# EAGLE board NEW LINE EN (EAGLE 9.6.2)
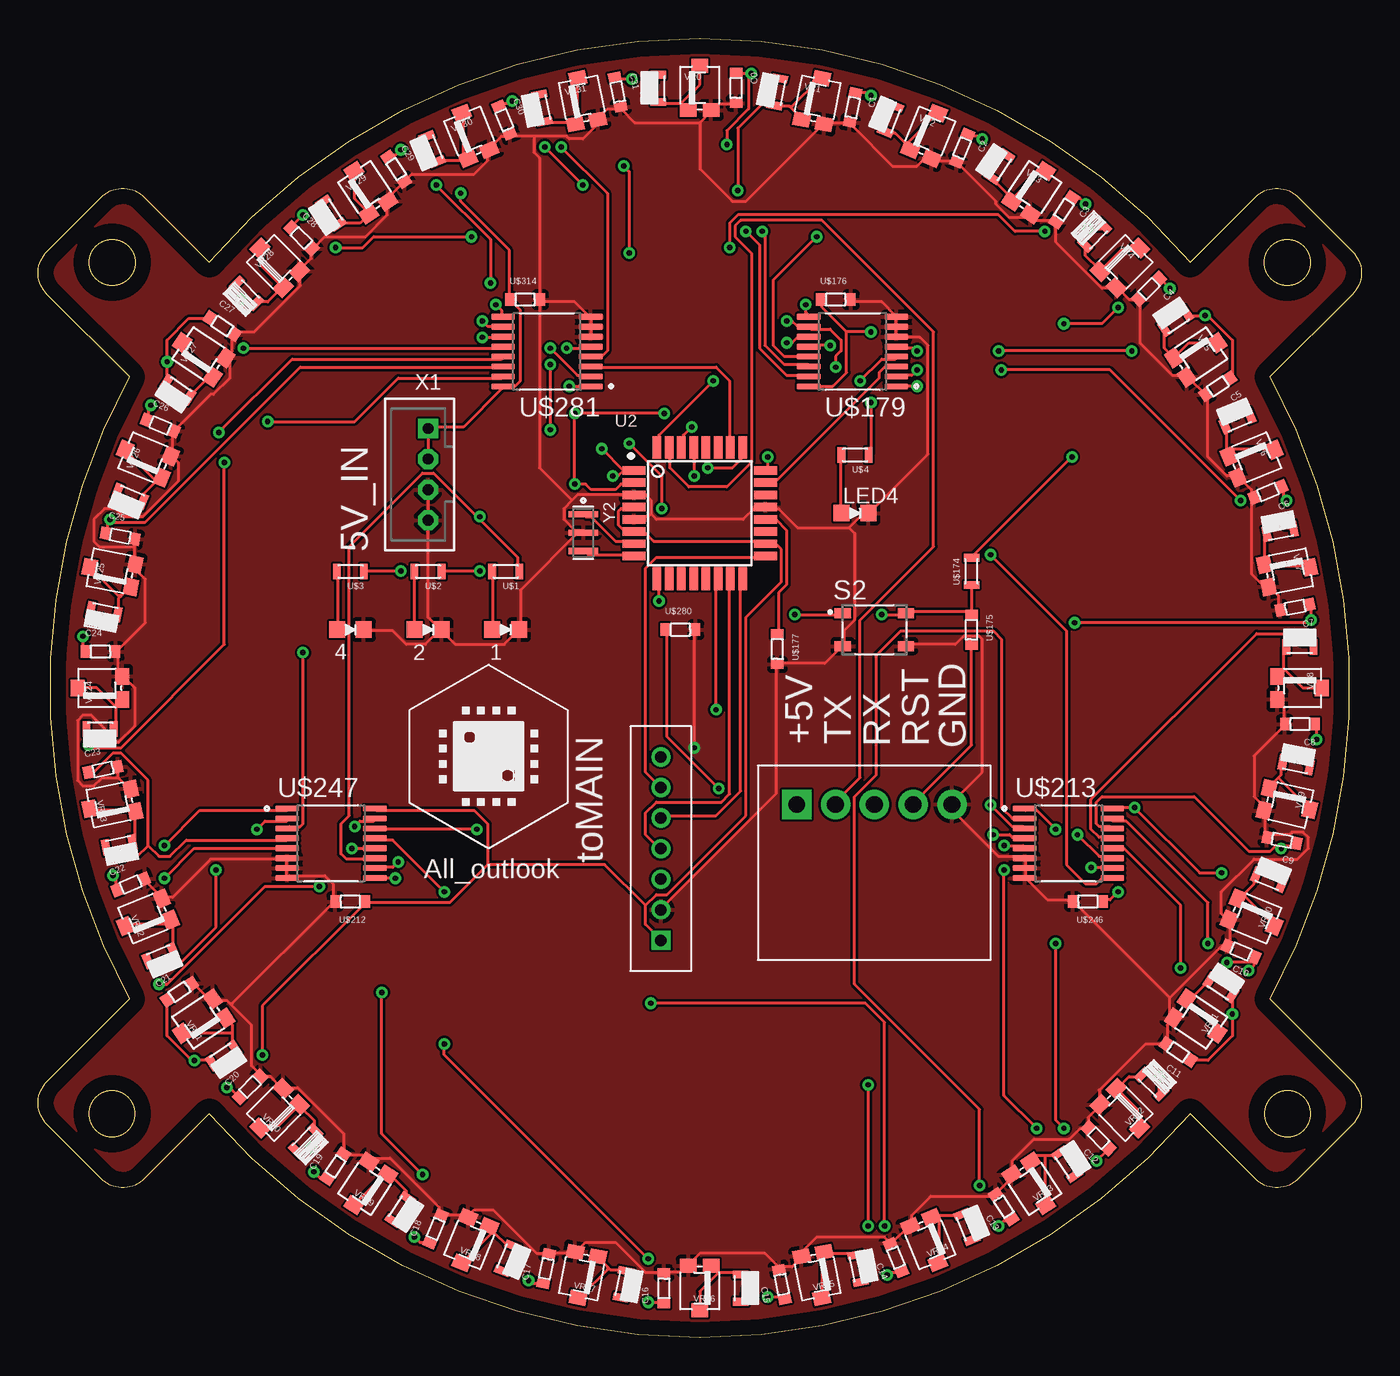
[diagram p2: board, top side]
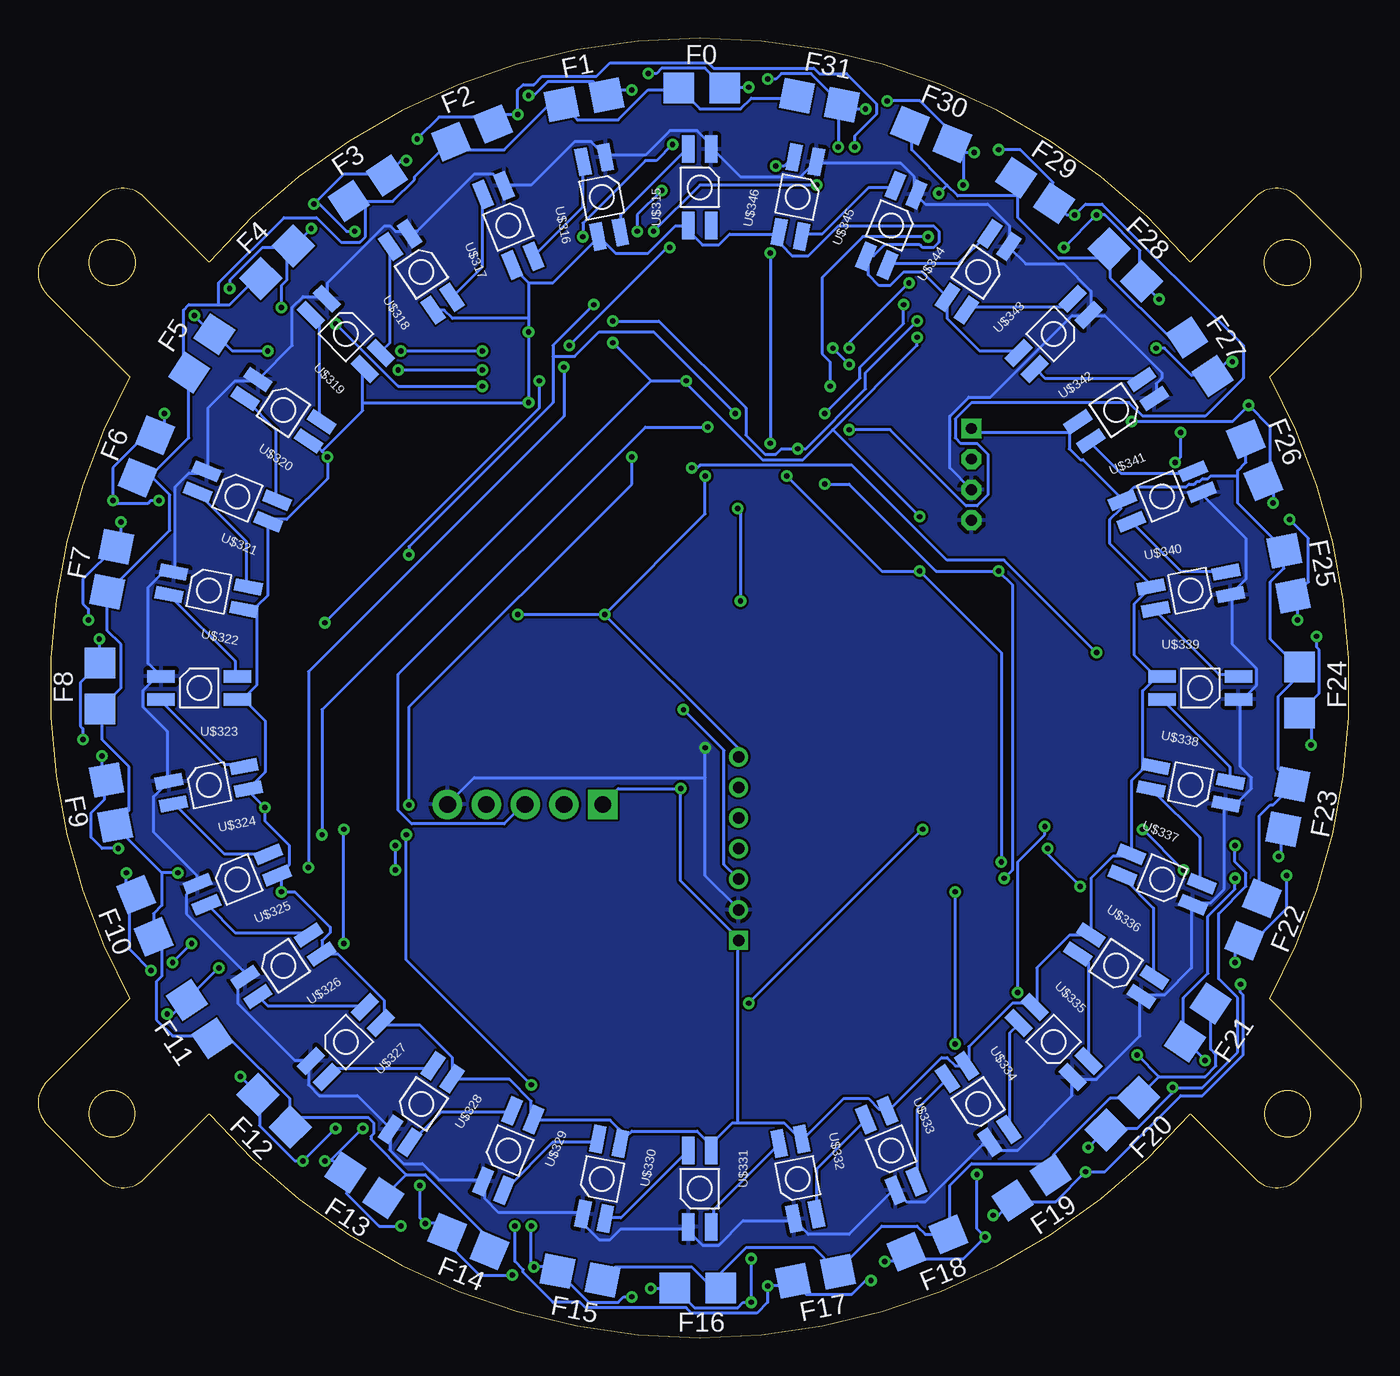
[diagram p3: board, bottom side, seen from below]

Size 86.58 x 85 mm. Coordinates in mm from the lower left corner, seen from the top.
Outline: 5.97,22.16 arc-57 5.97,62.84 0.58,68.23 arc-90 0.58,71.06 4.12,74.6 arc-90 6.95,74.6 11.19,70.36 arc-98 75.39,70.36 79.63,74.6 arc-90 82.46,74.6 85.99,71.06 arc-90 85.99,68.23 80.6,62.84 arc-57 80.6,22.16 85.99,16.77 arc-90 85.99,13.94 82.46,10.4 arc-90 79.63,10.4 75.39,14.64 arc-98 11.19,14.64 6.95,10.4 arc-90 4.12,10.4 0.58,13.94 arc-90 0.58,16.77 5.97,22.16
Outline: circle at 81.75,14.65 radius 1.5
Outline: circle at 4.85,70.34 radius 1.5
Outline: circle at 4.83,14.65 radius 1.5
Outline: circle at 81.73,70.34 radius 1.5
Copper layers (1*16): Top 0.035mm / dielectric 1.5mm / Bottom 0.035mm
Design rules "default": minimum track width 6mil, minimum drill 0.35mm, track to track 6mil, track to pad 6mil, pad to pad 6mil, via to via 6mil, smd to smd 6mil, copper to edge 40mil, drill to drill 6mil, minimum pad ring 10mil, minimum via ring 8mil, stop-mask expansion 4mil, vias tented up to drill 0mil, thermal gap 10mil
Net classes: 0 default: width 0.203 mm, clearance 0.127 mm

## Footprints (pad centres in the part's own frame; a part is rotated, then mirrored left to right if it is on the bottom)
LED1608 = smd 1.05 x 1.08: A -0.875,0; K 0.875,0
CON = smd 0.6 x 0.813: P$1 -1,0; P$2 1,0
PHOTO = smd 2 x 2 bottom: P$1 -1.365,0; P$2 1.635,0
1608 = smd 0.508 x 1.016: P$1 -0.889,0; P$2 0.889,0
SW_SKRPACE010 = smd 1.05 x 0.65: 1 -2.075,1.075; 2 2.075,1.075; 3 -2.075,-1.075; 4 2.075,-1.075
QFP80P900X900X120-32N = smd 1.5 x 0.55: 1 -4.3,2.8; 2 -4.3,2; 3 -4.3,1.2; 4 -4.3,0.4; 5 -4.3,-0.4; 6 -4.3,-1.2; 7 -4.3,-2; 8 -4.3,-2.8; 17 4.3,-2.8; 18 4.3,-2; 19 4.3,-1.2; 20 4.3,-0.4; 21 4.3,0.4; 22 4.3,1.2; 23 4.3,2; 24 4.3,2.8 | smd 0.55 x 1.5: 9 -2.8,-4.3; 10 -2,-4.3; 11 -1.2,-4.3; 12 -0.4,-4.3; 13 0.4,-4.3; 14 1.2,-4.3; 15 2,-4.3; 16 2.8,-4.3; 25 2.8,4.3; 26 2,4.3; 27 1.2,4.3; 28 0.4,4.3; 29 -0.4,4.3; 30 -1.2,4.3; 31 -2,4.3; 32 -2.8,4.3
SPI = drill 0.75 square: P$1 0,0 | drill 0.75: P$2 2,0; P$3 4,0; P$4 6,0; P$5 8,0; P$6 10,0; P$7 12,0
SI = drill 1.1 pad 1.93 square: P$1 -7.62,0 | drill 1.1 pad 1.93: P$2 -5.08,0; P$3 -2.54,0; P$4 0,0; P$5 2.54,0
SOP65P640X120-16N = smd 1.57 x 0.41: 1 -2.87,2.275; 2 -2.87,1.625; 3 -2.87,0.975; 4 -2.87,0.325; 5 -2.87,-0.325; 6 -2.87,-0.975; 7 -2.87,-1.625; 8 -2.87,-2.275; 9 2.87,-2.275; 10 2.87,-1.625; 11 2.87,-0.975; 12 2.87,-0.325; 13 2.87,0.325; 14 2.87,0.975; 15 2.87,1.625; 16 2.87,2.275
LED = smd 1.8 x 0.82: P$1 -2.5,0.75; P$2 -2.5,-0.75; P$3 2.5,-0.75; P$4 2.5,0.75
VR = smd 1.1 x 0.9: P$1 0,1.45; P$2 -0.75,-1.45; P$3 0.75,-1.45
B4B-PH-K-S = drill 0.7 pad 1.3 square: 1 3,0 | drill 0.7 pad 1.3 octagon: 2 1,0; 3 -1,0; 4 -3,0
OSC_CSTCE16M0V53-R0 = smd 0.4 x 1.9: 1 -1.2,0; 2 0,0; 3 1.2,0

## Placement (x,y rotation side)
1  LED1608  [LED1608]  30.59,46.31 0 top
2  LED1608  [LED1608]  25.51,46.31 0 top
4  LED1608  [LED1608]  20.43,46.31 0 top
C0  1608  [CON]  45.66,81.76 270 top
C1  1608  [CON]  53.3,80.46 258.7 top
C2  1608  [CON]  60.46,77.81 247.5 top
C3  1608  [CON]  67.13,73.78 236.2 top
C4  1608  [CON]  72.69,68.61 225 top
C5  1608  [CON]  77.2,62.24 213.7 top
C6  1608  [CON]  80.47,55.32 202.5 top
C7  1608  [CON]  82.25,47.78 191.2 top
C8  1608  [CON]  82.57,40.14 180 top
C9  1608  [CON]  81.39,32.53 168.7 top
C10  1608  [CON]  78.71,25.27 157.5 top
C11  1608  [CON]  74.59,18.69 146.2 top
C12  1608  [CON]  69.39,13.05 135 top
C13  1608  [CON]  63.18,8.57 123.7 top
C14  1608  [CON]  56.13,5.24 112.5 top
C15  1608  [CON]  48.66,3.49 101.2 top
C16  1608  [CON]  40.94,3.23 90 top
C17  1608  [CON]  33.24,4.52 78.7 top
C18  1608  [CON]  26,7.12 67.5 top
C19  1608  [CON]  19.45,11.21 56.2 top
C20  1608  [CON]  13.86,16.4 45 top
C21  1608  [CON]  9.24,22.63 33.7 top
C22  1608  [CON]  6.05,29.65 22.5 top
C23  1608  [CON]  4.24,37.17 11.2 top
C24  1608  [CON]  4.07,44.88 0 top
C25  1608  [CON]  5.37,52.43 348.8 top
C26  1608  [CON]  8,59.67 337.5 top
C27  1608  [CON]  12.05,66.17 326.3 top
C28  1608  [CON]  17.23,71.93 315 top
C29  1608  [CON]  23.43,76.44 303.8 top
C30  1608  [CON]  30.5,79.65 292.5 top
C31  1608  [CON]  37.92,81.49 281.3 top
F0  PHOTO  [PHOTO]  43.29,81.75 180 top
F1  PHOTO  [PHOTO]  50.98,80.96 168.7 top
F2  PHOTO  [PHOTO]  58.31,78.76 157.5 top
F3  PHOTO  [PHOTO]  65.12,75.12 146.2 top
F4  PHOTO  [PHOTO]  71.04,70.25 135 top
F5  PHOTO  [PHOTO]  75.94,64.28 123.7 top
F6  PHOTO  [PHOTO]  79.55,57.52 112.5 top
F7  PHOTO  [PHOTO]  81.79,50.12 101.2 top
F8  PHOTO  [PHOTO]  82.54,42.5 90 top
F9  PHOTO  [PHOTO]  81.79,34.88 78.8 top
F10  PHOTO  [PHOTO]  79.55,27.48 67.5 top
F11  PHOTO  [PHOTO]  75.94,20.72 56.3 top
F12  PHOTO  [PHOTO]  71.04,14.75 45 top
F13  PHOTO  [PHOTO]  65.12,9.88 33.8 top
F14  PHOTO  [PHOTO]  58.31,6.24 22.5 top
F15  PHOTO  [PHOTO]  50.98,4.04 11.3 top
F16  PHOTO  [PHOTO]  43.29,3.25 0 top
F17  PHOTO  [PHOTO]  35.6,4.04 348.8 top
F18  PHOTO  [PHOTO]  28.27,6.24 337.5 top
F19  PHOTO  [PHOTO]  21.45,9.88 326.3 top
F20  PHOTO  [PHOTO]  15.53,14.75 315 top
F21  PHOTO  [PHOTO]  10.63,20.72 303.8 top
F22  PHOTO  [PHOTO]  7.03,27.48 292.5 top
F23  PHOTO  [PHOTO]  4.79,34.88 281.3 top
F24  PHOTO  [PHOTO]  4.04,42.5 270 top
F25  PHOTO  [PHOTO]  4.79,50.12 258.8 top
F26  PHOTO  [PHOTO]  7.03,57.52 247.5 top
F27  PHOTO  [PHOTO]  10.63,64.28 236.3 top
F28  PHOTO  [PHOTO]  15.53,70.25 225 top
F29  PHOTO  [PHOTO]  21.45,75.12 213.8 top
F30  PHOTO  [PHOTO]  28.27,78.76 202.5 top
F31  PHOTO  [PHOTO]  35.6,80.96 191.3 top
LED4  LED1608  [LED1608]  53.45,53.93 0 top
R0  R  [1608]  40.58,81.72 90 top
R1  R  [1608]  48.36,81.49 78.7 top
R2  R  [1608]  55.76,79.72 67.5 top
R3  R  [1608]  62.9,76.61 56.2 top
R4  R  [1608]  69.12,72.09 45 top
R5  R  [1608]  74.42,66.49 33.7 top
R6  R  [1608]  78.48,59.96 22.5 top
R7  R  [1608]  81.26,52.74 11.2 top
R8  R  [1608]  82.56,45.19 0 top
R9  R  [1608]  82.32,37.47 348.8 top
R10  R  [1608]  80.54,29.97 337.5 top
R11  R  [1608]  77.4,22.9 326.3 top
R12  R  [1608]  72.87,16.59 315 top
R13  R  [1608]  67.32,11.35 303.8 top
R14  R  [1608]  60.76,7.25 292.5 top
R15  R  [1608]  53.64,4.53 281.3 top
R16  R  [1608]  45.97,3.25 270 top
R17  R  [1608]  38.3,3.5 258.8 top
R18  R  [1608]  30.72,5.19 247.5 top
R19  R  [1608]  23.69,8.39 236.3 top
R20  R  [1608]  17.49,12.88 225 top
R21  R  [1608]  12.12,18.46 213.8 top
R22  R  [1608]  8,24.99 202.5 top
R23  R  [1608]  5.3,32.25 191.3 top
R24  R  [1608]  4.05,39.82 180 top
R25  R  [1608]  4.31,47.48 168.8 top
R26  R  [1608]  6.01,55.04 157.5 top
R27  R  [1608]  9.14,62.03 146.3 top
R28  R  [1608]  13.62,68.32 135 top
R29  R  [1608]  19.15,73.58 123.8 top
R30  R  [1608]  25.78,77.76 112.5 top
R31  R  [1608]  32.96,80.44 101.3 top
S2  SKRPACE010  [SW_SKRPACE010]  54.72,46.31 0 top
U2  ATMEGA328P-AU  [QFP80P900X900X120-32N]  43.29,53.93 0 top
U$1  R  [1608]  30.59,50.12 180 top
U$2  R  [1608]  25.51,50.12 180 top
U$3  R  [1608]  20.43,50.12 180 top
U$4  R  [1608]  53.45,57.74 180 top
U$5  SPI  [SPI]  40.75,25.99 90 top
U$6  SI  [SI]  57.26,34.88 0 top
U$7  ALL  [ALL]  29.47,38.03 0 top
U$174  R  [1608]  61.07,50.12 90 top
U$175  1608  [CON]  61.07,46.31 270 top
U$176  1608  [CON]  52.18,67.9 0 top
U$177  1608  [CON]  48.37,45.04 270 top
U$179  AM  [SOP65P640X120-16N]  53.29,64.5 180 top
U$212  1608  [CON]  20.43,28.53 180 top
U$213  AM  [SOP65P640X120-16N]  67.42,32.34 0 top
U$246  1608  [CON]  68.69,28.53 180 top
U$247  AM  [SOP65P640X120-16N]  19.16,32.34 0 top
U$280  1608  [CON]  42.02,46.31 0 top
U$281  AM  [SOP65P640X120-16N]  33.29,64.5 180 top
U$314  1608  [CON]  31.86,67.9 0 top
U$315  LED  [LED]  43.29,75.25 90 bottom
U$316  LED  [LED]  49.71,74.62 101.3 bottom
U$317  LED  [LED]  55.82,72.76 112.5 bottom
U$318  LED  [LED]  61.51,69.72 123.8 bottom
U$319  LED  [LED]  66.45,65.66 135 bottom
U$320  LED  [LED]  70.54,60.67 146.3 bottom
U$321  LED  [LED]  73.55,55.03 157.5 bottom
U$322  LED  [LED]  75.41,48.86 168.8 bottom
U$323  LED  [LED]  76.04,42.5 180 bottom
U$324  LED  [LED]  75.41,36.14 191.2 bottom
U$325  LED  [LED]  73.55,29.97 202.5 bottom
U$326  LED  [LED]  70.54,24.33 213.7 bottom
U$327  LED  [LED]  66.45,19.34 225 bottom
U$328  LED  [LED]  61.51,15.29 236.2 bottom
U$329  LED  [LED]  55.82,12.24 247.5 bottom
U$330  LED  [LED]  49.71,10.39 258.7 bottom
U$331  LED  [LED]  43.29,9.75 270 bottom
U$332  LED  [LED]  36.87,10.39 281.2 bottom
U$333  LED  [LED]  30.76,12.24 292.5 bottom
U$334  LED  [LED]  25.07,15.29 303.7 bottom
U$335  LED  [LED]  20.13,19.34 315 bottom
U$336  LED  [LED]  16.04,24.33 326.2 bottom
U$337  LED  [LED]  13.03,29.97 337.5 bottom
U$338  LED  [LED]  11.16,36.14 348.7 bottom
U$339  LED  [LED]  10.54,42.5 0 bottom
U$340  LED  [LED]  11.16,48.86 11.2 bottom
U$341  LED  [LED]  13.03,55.03 22.5 bottom
U$342  LED  [LED]  16.04,60.67 33.7 bottom
U$343  LED  [LED]  20.13,65.66 45 bottom
U$344  LED  [LED]  25.07,69.72 56.2 bottom
U$345  LED  [LED]  30.76,72.76 67.5 bottom
U$346  LED  [LED]  36.87,74.62 78.7 bottom
VR0  VR  [VR]  43.29,81.75 0 top
VR1  VR  [VR]  50.98,80.96 348.7 top
VR2  VR  [VR]  58.31,78.76 337.5 top
VR3  VR  [VR]  65.12,75.12 326.2 top
VR4  VR  [VR]  71.04,70.25 315 top
VR5  VR  [VR]  75.94,64.28 303.7 top
VR6  VR  [VR]  79.55,57.52 292.5 top
VR7  VR  [VR]  81.79,50.12 281.2 top
VR8  VR  [VR]  82.54,42.5 270 top
VR9  VR  [VR]  81.79,34.88 256.8 top
VR10  VR  [VR]  79.55,27.48 247.5 top
VR11  VR  [VR]  75.94,20.72 236.3 top
VR12  VR  [VR]  71.04,14.75 225 top
VR13  VR  [VR]  65.12,9.88 213.8 top
VR14  VR  [VR]  58.31,6.24 202.5 top
VR15  VR  [VR]  50.98,4.04 191.3 top
VR16  VR  [VR]  43.29,3.25 180 top
VR17  VR  [VR]  35.6,4.04 168.8 top
VR18  VR  [VR]  28.27,6.24 157.5 top
VR19  VR  [VR]  21.45,9.88 146.3 top
VR20  VR  [VR]  15.53,14.75 135 top
VR21  VR  [VR]  10.63,20.72 123.8 top
VR22  VR  [VR]  7.03,27.48 112.5 top
VR23  VR  [VR]  4.79,34.88 101.3 top
VR24  VR  [VR]  4.04,42.5 90 top
VR25  VR  [VR]  4.79,50.12 78.8 top
VR26  VR  [VR]  7.03,57.52 67.5 top
VR27  VR  [VR]  10.63,64.28 56.3 top
VR28  VR  [VR]  15.53,70.25 45 top
VR29  VR  [VR]  21.45,75.12 33.8 top
VR30  VR  [VR]  28.27,78.76 22.5 top
VR31  VR  [VR]  35.6,80.96 11.3 top
X1  B4B-PH-K-S  [B4B-PH-K-S]  25.51,56.47 90 top
Y2  CSTCE16M0V53-R0  [OSC_CSTCE16M0V53-R0]  35.67,52.66 270 top

## Tracks (layer width: path | path; a pad name or v marks a point on that pad's centre or on a via)
+5V  (via drill 0.35)
  Top 0.203: X1.2 X1.1 25.51,59.57 27.82,59.57 30.31,62.06 U$281.16 30.49,62.24 31.2,62.24 31.55,62.59 31.55,67.21 31.02,67.75 U$314.P$1 30.84,67.93 30.84,71.13 27.64,74.33 v27.64,74.86 | 52.89,65.79 51.29,67.39 51.29,67.75 U$176.P$1 | 52.89,65.79 52.89,63.13 52,62.24 50.58,62.24 U$179.16 | v54.49,61.17 54.49,57.79 U$4.P$1 | v54.49,65.79 52.89,65.79 | U$213.16 70.31,34.68 v71.74,34.68 76,30.41 v77.43,30.41 | v70.67,29.17 70.14,28.63 69.78,28.63 U$246.P$1 | v67.65,57.61 61.07,51.03 U$174.P$2 | v44.53,35.92 41.15,39.3 41.15,46.23 U$280.P$1 | 29.42,30.94 26.93,28.45 21.6,28.45 U$212.P$1 21.42,28.45 14.66,21.7 v14.66,18.5 | 29.42,30.94 29.42,33.61 28.53,34.5 22.13,34.5 U$247.16 | U2.4 38.84,54.24 38.13,54.24 37.95,54.06 37.95,53.17 38.31,52.81 38.84,52.81 U2.6 39.02,52.64 39.73,52.64 40.27,52.1 47.56,52.1 U2.18 47.73,51.92 48.27,51.92 48.62,51.57 48.62,49.43 46.31,47.12 46.31,34.14 41.15,28.99 40.44,28.99 39.73,28.28 | 39.73,28.28 39.73,27.03 40.62,26.14 U$5.P$1 | 29.42,30.94 37.07,30.94 39.73,28.28
  Bottom 0.203: F31.P$1 37.07,81.08 39.91,81.08 40.62,80.37 43.29,80.37 44.53,81.62 F0.P$1 44.71,81.62 46.67,81.62 48.62,79.66 51.29,79.66 52.18,80.55 F1.P$1 52.36,80.55 53.25,80.55 56.09,77.7 58.93,77.7 59.47,78.24 F2.P$1 59.65,78.24 61.96,75.93 61.96,75.75 63.38,74.33 65.16,74.33 | 65.16,74.33 66.22,74.33 F3.P$1 65.16,74.33 | 62.49,10.67 61.25,10.67 57.16,6.58 57.16,5.87 F14.P$1 | 62.49,10.67 63.91,9.25 F13.P$1 | 70.14,14.41 70.14,15.65 74.05,19.56 75.11,19.56 F11.P$1 75.29,19.74 77.78,19.74 78.85,20.81 78.85,23.3 78.49,23.65 78.49,25.61 79.03,26.14 F10.P$1 79.03,26.32 79.03,27.74 78.49,28.28 78.49,30.41 | 70.14,14.41 70.14,13.87 F12.P$1 70.14,14.41 | 62.49,10.67 64.8,12.99 64.8,13.16 64.62,13.34 64.62,14.05 64.98,14.41 70.14,14.41 | 79.2,56.37 76.71,58.86 76.71,63.13 F5.P$1 76.71,63.3 77.07,63.66 77.07,67.21 76.71,67.57 74.76,67.57 | 79.2,56.37 79.92,56.37 F6.P$1 79.2,56.37 | 74.76,67.57 74.05,67.57 72.45,69.17 72.09,69.17 F4.P$1 | 82.05,48.72 82.05,46.23 81.16,45.35 81.16,42.5 82.4,41.26 F8.P$1 82.4,41.08 82.4,39.12 80.63,37.34 80.63,34.5 81.52,33.61 F9.P$1 81.52,33.43 78.49,30.41 | 79.2,56.37 77.96,55.12 77.96,52.81 82.05,48.72 | 82.05,48.72 F7.P$1 | 65.16,74.33 65.16,72.02 65.51,71.66 66.76,71.66 68.36,73.26 70.49,73.26 74.76,68.99 74.76,67.57 | F22.P$1 6.66,28.81 6.66,34.14 5.95,34.86 5.77,34.86 4.53,36.1 F23.P$1 4.53,36.28 5.42,37.17 5.42,41.97 4.17,43.21 4.17,43.75 F24.P$1 4.17,43.92 5.95,45.7 5.95,49.43 5.06,50.32 5.06,51.39 F25.P$1 5.06,51.57 8.08,54.59 8.08,56.37 | 8.08,56.37 8.08,56.72 7.55,57.26 7.55,58.68 F26.P$1 | 16.44,70.59 16.44,71.13 F28.P$1 16.44,70.59
  Bottom 0.203: 16.44,70.59 16.44,69.35 12.53,65.44 11.46,65.44 F27.P$1 | 22.49,74.68 22.49,73.26 19.82,70.59 16.44,70.59 | 22.49,74.68 22.49,75.75 F29.P$1 22.49,74.68 | 27.11,75.39 26.4,74.68 22.49,74.68 | 27.11,75.39 29.42,77.7 29.42,79.13 F30.P$1 | 19.11,59.21 19.11,58.15 18.4,57.44 18.22,57.44 15.73,54.95 U$341.P$1 | 19.11,59.21 18.57,59.75 U$342.P$1 19.11,59.21 | 19.11,59.21 25.33,59.21 25.51,59.39 X1.1 | 21.24,21.88 21.24,24.19 19.11,26.32 17.86,26.32 U$336.P$1 17.69,26.5 17.69,30.05 16.26,31.48 15.2,31.48 U$337.P$1 15.02,31.65 15.02,36.46 14.31,37.17 | 21.24,21.88 21.24,21.7 U$335.P$1 21.24,21.88 | 14.31,37.17 14.13,37.34 13.6,37.34 U$338.P$1 14.31,37.17 | 13.42,43.21 13.06,43.21 U$339.P$1 13.42,43.21 | 13.42,43.21 14.31,42.32 14.31,37.17 | 13.42,43.21 14.84,44.63 14.84,48.01 13.77,49.08 U$340.P$1 13.77,49.26 16.44,51.92 16.44,53.52 15.73,54.24 15.73,54.77 U$341.P$1 | 21.24,21.88 22.84,21.88 25.69,19.03 25.69,17.79 U$334.P$1 25.86,17.79 26.58,17.79 27.11,18.32 27.46,18.32 30.84,14.94 U$333.P$1 31.02,14.94 31.55,14.94 32.26,15.65 33.87,15.65 36.53,12.99 U$332.P$1 36.71,12.99 37.78,14.05 40.8,14.05 | v27.64,74.86 27.11,75.39 | 8.08,56.37 9.86,56.37 10.04,56.19 10.4,56.19 10.57,56.01 10.75,56.01 10.93,55.84 11.28,55.84 11.46,55.66 14.84,55.66 15.55,54.95 U$341.P$1 | 13.24,17.08 10.22,17.08 9.51,17.79 9.51,18.5 9.86,18.85 9.86,21.7 F21.P$1 | 13.24,17.08 14.48,15.83 F20.P$1 14.66,15.65 16.44,15.65 20.17,11.92 20.17,11.39 | 20.17,11.39 20.17,10.67 F19.P$1 20.17,11.39 | F15.P$1 49.51,3.92 48.8,4.63 43.82,4.63 42.58,3.38 42.04,3.38 F16.P$1 41.87,3.38 41.87,4.27 40.27,5.87 35.82,5.87 34.4,4.45 F17.P$1 34.22,4.45 31.38,7.3 29.06,7.3 28.53,6.76 27.11,6.76 F18.P$1 26.93,6.76 26.93,9.96 25.51,11.39 20.17,11.39
  Bottom 0.203: U$343.P$1 22.49,64.55 24.98,64.55 27.11,66.68 27.11,67.93 U$344.P$1 27.11,68.1 28.71,69.7 29.95,69.7 30.84,68.81 31.55,68.81 32.26,69.53 32.26,70.59 U$345.P$1 32.26,70.77 31.91,70.77 31.2,71.48 28.89,71.48 28.71,71.3 28,71.3 27.64,71.66 27.64,72.37 28,72.73 34.22,72.73 36.18,70.77 37.24,70.77 37.95,71.48 37.95,72.19 U$346.P$1 38.13,72.19 41.33,72.19 42.04,71.48 43.11,71.48 44,72.37 44,72.73 U$315.P$1 44.18,72.73 44.89,72.73 46.67,70.95 48.8,70.95 49.87,72.02 U$316.P$1 50.04,72.02 50.04,71.84 52.89,68.99 54.49,68.99 | 54.49,68.99 54.49,66.68 | 54.49,66.68 v54.49,65.79 v54.49,61.17 65.34,61.17 | 54.49,68.99 55.56,70.06 U$317.P$1 | 54.49,66.68 59.47,66.68 60,67.21 60.71,67.21 U$318.P$1 | 72.27,47.83 71.56,48.55 71.56,53.35 U$321.P$1 71.38,53.52 70.31,53.52 67.65,56.19 v67.65,57.61 68,57.97 | 72.27,47.83 72.45,47.66 72.98,47.66 U$322.P$1 72.27,47.83 | 73.16,41.79 73.51,41.79 U$323.P$1 73.16,41.79 | 73.16,41.79 72.27,42.68 72.27,47.83 | 68,57.97 68.71,58.68 U$320.P$1 | 65.34,61.17 65.34,60.64 68,57.97 | 65.34,61.17 65.34,63.3 U$319.P$1 | 73.16,41.79 71.74,40.37 71.74,36.99 72.8,35.92 U$324.P$1 72.8,35.74 v71.74,34.68 71.74,33.79 70.14,32.19 70.14,30.94 70.85,30.23 U$325.P$1 70.85,30.05 70.67,29.88 v70.67,29.17 69.78,29.17 67.47,26.85 67.47,26.5 68,25.97 68,25.25 U$326.P$1 68,25.08 66.94,25.08 63.91,22.05 63.91,20.45 | U$6.P$1 49.51,35.03 48.62,35.92 v44.53,35.92 44.53,29.88 40.8,26.14 U$5.P$1 40.8,25.97 40.8,14.05 | 42.58,12.63 42.58,12.27 U$331.P$1 42.58,12.63 | 42.58,12.63 43.47,13.52 47.73,13.52 48.09,13.16 | 48.09,13.16 48.44,12.81 U$330.P$1 48.09,13.16
  Bottom 0.203: 40.8,14.05 41.15,14.05 42.58,12.63 | 48.09,13.16 49.16,14.23 54.13,14.23 U$329.P$1 54.31,14.41 54.31,15.47 55.73,16.9 59.47,16.9 U$328.P$1 59.47,17.08 59.47,18.32 61.6,20.45 63.91,20.45 | 63.91,20.45 64.09,20.45 U$327.P$1 63.91,20.45 | v14.66,18.5 13.24,17.08 | v77.43,30.41 78.49,30.41
A0
  Top 0.203: U2.23 47.73,56.01 48.27,56.01 55.02,62.77 55.02,63.13 55.38,63.48 56.09,63.48 U$179.3
A1  (via drill 0.35)
  Top 0.203: v47.73,57.61 47.73,56.9 U2.24 | v62.31,34.86 63.74,33.43 64.45,33.43 U$213.3
  Bottom 0.203: v47.73,57.61 47.73,55.84 62.31,41.26 v62.31,34.86
A2  (via drill 0.35)
  Top 0.203: v43.82,56.9 45.42,56.9 45.96,57.44 45.96,58.15 U2.25 | v17.33,44.81 17.33,33.61 17.15,33.43 16.44,33.43 U$247.3
  Bottom 0.203: v43.82,56.9 43.47,56.9 43.29,57.08 33.33,57.08 27.11,50.86 23.37,50.86 v17.33,44.81
A3
  Top 0.203: U2.26 45.24,58.32 45.24,62.59 44.36,63.48 36.18,63.48 U$281.3
CH0  (via drill 0.35)
  Top 0.203: 46.49,82.68 45.78,82.68 C0.P$1 | v40.09,81.79 40.44,82.15 40.44,82.51 R0.P$2 | v50.93,72.02 48.09,69.17 48.09,64.9 48.8,64.19 50.4,64.19 U$179.13 | v45.07,78.06 45.07,78.95 46.49,80.37 46.49,82.68 | 46.49,82.68 v46.67,82.68
  Bottom 0.203: v46.67,82.68 46.13,82.68 45.78,83.04 42.93,83.04 41.69,81.79 F0.P$2 41.51,81.79 v40.09,81.79 | v50.93,72.02 50.93,72.9 46.84,76.99 46.13,76.99 v45.07,78.06
CH1  (via drill 0.35)
  Top 0.203: v54.49,81.26 54.31,81.44 53.6,81.44 C1.P$1 | R1.P$2 48.44,82.33 v47.73,81.62 47.38,81.26 47.38,80.73 45.78,79.13 v45.78,75.04 | v47.38,72.37 47.56,72.19 47.56,64.9 48.8,63.66 50.4,63.66 U$179.14
  Bottom 0.203: v54.49,81.26 54.13,81.26 53.25,82.15 50.22,82.15 49.51,81.44 F1.P$2 49.33,81.44 49.16,81.62 v47.73,81.62 | v47.38,72.37 47.38,73.44 v45.78,75.04
CH2  (via drill 0.35)
  Top 0.203: v61.78,78.42 61.6,78.59 60.89,78.59 C2.P$1 | v55.2,80.02 55.56,80.37 56.09,80.37 R2.P$2 | v46.31,72.37 47.2,71.48 47.2,64.73 48.98,62.95 50.4,62.95 U$179.15 | v33.15,77.88 v35.64,75.39
  Bottom 0.203: v61.78,78.42 60.36,79.84 57.16,79.84 56.8,79.48 F2.P$2 56.62,79.48 56.09,80.02 v55.2,80.02 55.2,81.62 54.85,81.97 54.13,81.97 53.6,82.51 50.04,82.51 49.16,83.39 42.76,83.39 42.4,83.04 35.82,83.04 35.47,82.68 33.69,82.68 31.73,80.73 31.73,80.02 33.15,78.59 v33.15,77.88 | v46.31,72.37 43.29,75.39 v35.64,75.39
CH3  (via drill 0.35)
  Top 0.203: v68.54,74.15 68.18,74.5 67.82,74.5 C3.P$1 | v62.49,76.99 62.85,77.35 R3.P$2 | v51.82,64.9 50.58,64.9 U$179.12 | v45.24,71.3 45.24,72.9 45.78,73.44 62.85,73.44 63.91,72.37 v65.87,72.37
  Bottom 0.203: 68.36,74.33 66.58,76.1 63.91,76.1 F3.P$2 63.74,76.1 62.85,76.99 v62.49,76.99 | v51.82,64.9 45.42,71.3 v45.24,71.3 | v65.87,72.37 66.4,72.37 68.36,74.33 | 68.36,74.33 v68.54,74.15
CH4  (via drill 0.35)
  Top 0.203: v74.05,68.64 73.51,69.17 C4.P$1 | v68.71,72.55 69.6,72.55 R4.P$2 | v57.51,62.24 56.27,62.24 U$179.1 | v67.11,66.33 69.6,66.33 v70.67,67.39
  Bottom 0.203: v74.05,68.64 74.05,69.17 71.91,71.3 70.31,71.3 | 70.31,71.3 69.96,71.3 F4.P$2 | v68.71,72.55 69.78,71.48 F4.P$2 | v57.51,62.24 63.02,62.24 v67.11,66.33 | v70.67,67.39 70.67,68.81 70.31,69.17 70.31,71.3 | 70.31,71.3 F4.P$2
CH5  (via drill 0.35)
  Top 0.203: C5.P$1 78.14,62.95 78.14,65.26 76.54,66.86 v76.36,66.86 75.29,66.86 R5.P$2 | v57.51,64.55 57.33,64.73 56.27,64.73 U$179.5 | v71.56,64.55 v62.85,64.55
  Bottom 0.203: v62.85,64.55 v57.51,64.55 | v71.56,64.55 73.87,64.55 74.94,65.61 F5.P$2 75.11,65.61 v76.36,66.86
CH6  (via drill 0.35)
  Top 0.203: v81.69,54.77 81.52,54.95 81.52,55.66 C6.P$1 | v78.32,60.46 79.2,60.46 R6.P$2 | v57.51,63.3 57.16,62.95 56.27,62.95 U$179.2 | v63.02,63.3 70.14,63.3 v78.67,54.77
  Bottom 0.203: v78.32,60.46 78.32,59.57 78.85,59.04 F6.P$2 79.03,58.86 79.74,58.86 81.69,56.9 v81.69,54.77 81.52,54.59 79.38,54.59 79.2,54.77 v78.67,54.77 | v63.02,63.3 v57.51,63.3
CH7  (via drill 0.35)
  Top 0.203: C7.P$1 83.29,47.83 v83.29,46.95 83.12,46.77 v67.82,46.77 | v81.16,53.35 81.52,52.99 82.05,52.99 R7.P$2 | v53.78,62.59 55.2,64.01 56.09,64.01 U$179.4
  Bottom 0.203: v83.29,46.95 83.29,47.66 83.65,48.01 83.65,49.61 81.52,51.75 F7.P$2 81.34,51.75 81.16,51.92 v81.16,53.35 | v53.78,62.59 53.78,60.81 v67.82,46.77
CH8  (via drill 0.35)
  Top 0.203: v83.65,39.12 83.65,40.01 C8.P$1 | 82.4,45.7 82.05,46.06 79.74,46.06 68.89,35.21 68.89,33.25 69.43,32.72 70.14,32.72 U$213.13 | 82.4,45.7 82.76,45.35 83.29,45.35 R8.P$2 | 82.4,45.7 v82.58,45.7
  Bottom 0.203: v83.65,39.12 83.65,39.83 83.83,40.01 83.83,42.86 82.58,44.1 F8.P$2 82.58,44.28 v82.58,45.7
CH9  (via drill 0.35)
  Top 0.203: v82.4,38.06 83.12,37.34 R9.P$2 | 81.34,32.19 80.98,32.19 80.63,31.83 79.2,31.83 75.65,35.39 69.6,35.39 69.25,35.03 69.25,33.61 69.43,33.43 70.14,33.43 U$213.14 | 81.34,32.19 82.23,32.19 C9.P$1 | 81.34,32.19 v81.34,32.01
  Bottom 0.203: v82.4,38.06 82.4,36.81 82.23,36.63 F9.P$2 82.23,36.46 82.23,35.21 83.12,34.32 83.12,32.72 82.4,32.01 v81.34,32.01
CH10  (via drill 0.35)
  Top 0.203: 79.56,24.54 79.56,24.36 v79.2,24.01 | 79.56,24.54 79.56,24.72 C10.P$1 79.56,24.54 | v80.8,30.41 80.8,30.23 81.34,29.7 R10.P$2 | v76.54,25.79 76.54,28.45 71.2,33.79 70.31,33.79 U$213.15 | 79.56,24.54 v77.78,24.54
  Bottom 0.203: v79.2,24.01 80.63,25.43 80.63,28.63 80.27,28.99 F10.P$2 80.27,29.17 80.8,29.7 v80.8,30.41 | v77.78,24.54 v76.54,25.79
CH11  (via drill 0.35)
  Top 0.203: C11.P$1 75.47,18.14 76.54,18.14 78.14,19.74 v78.14,21.16 R11.P$2 | v74.76,24.19 74.76,28.28 71.03,32.01 70.31,32.01 U$213.12
  Bottom 0.203: v74.76,24.19 76.71,22.23 F11.P$2 76.89,22.05 77.78,21.16 v78.14,21.16
CH12  (via drill 0.35)
  Top 0.203: v69.25,11.56 69.96,12.27 C12.P$1 | v73.34,17.08 73.34,16.01 R12.P$2 | v66.58,33.25 65.34,34.5 64.62,34.5 U$213.1 | v66.58,25.79 66.58,14.23 v67.11,13.7
  Bottom 0.203: v73.34,17.08 72.27,16.01 F12.P$2 72.09,15.83 72.09,13.87 69.78,11.56 v69.25,11.56 v67.11,13.7 | v66.58,25.79 v66.58,33.25
CH13  (via drill 0.35)
  Top 0.203: v62.85,7.3 63.2,7.65 63.56,7.65 C13.P$1 | v67.82,11.56 67.82,10.67 R13.P$2 | v63.2,32.19 64.45,32.19 U$213.5 | v63.2,30.59 63.2,15.83 v65.34,13.7
  Bottom 0.203: v62.85,7.3 64.27,7.3 66.4,9.43 66.4,10.67 F13.P$2 66.58,10.85 67.29,11.56 67.47,11.56 | v63.2,30.59 v63.2,32.19 | 67.47,11.56 v65.34,13.7 | 67.47,11.56 v67.82,11.56
CH14  (via drill 0.35)
  Top 0.203: v55.56,4.1 55.73,4.27 56.45,4.27 C14.P$1 | v61.25,7.47 61.25,6.58 R14.P$2 | v61.6,9.96 61.6,14.94 53.42,23.12 53.42,35.39 54.85,36.81 54.85,44.63 56.45,46.23 62.49,46.23 63.02,45.7 63.02,34.68 63.74,33.97 64.45,33.97 U$213.2
  Bottom 0.203: v55.56,4.1 57.69,4.1 59.65,6.05 59.65,6.76 F14.P$2 59.82,6.94 60.36,7.47 v61.25,7.47 61.6,7.83 v61.6,9.96
CH15  (via drill 0.35)
  Top 0.203: v47.73,2.67 48.8,2.67 C15.P$1 | v54.13,4.63 53.96,4.45 53.96,3.74 R15.P$2 | v62.49,32.9 63.56,32.9 63.74,32.72 64.45,32.72 U$213.4 | v54.31,7.3 v54.31,16.54
  Bottom 0.203: v47.73,2.67 48.27,2.67 48.62,2.32 50.58,2.32 52.53,4.27 F15.P$2 52.71,4.45 52.89,4.63 v54.13,4.63 54.31,4.81 v54.31,7.3 | v62.49,32.9 62.49,24.72 v54.31,16.54
CH16  (via drill 0.35)
  Top 0.203: v39.91,2.32 40.8,2.32 C16.P$1 | v46.49,3.21 46.13,2.85 46.13,2.5 R16.P$2 | v26.58,29.17 23.2,32.54 22.13,32.54 U$247.13 | v26.58,19.21 26.58,18.5 v39.91,5.16
  Bottom 0.203: v46.49,3.21 45.07,3.21 F16.P$2 44.89,3.21 43.64,1.96 40.8,1.96 40.44,2.32 v39.91,2.32 v39.91,5.16 | v26.58,19.21 v26.58,29.17
CH17  (via drill 0.35)
  Top 0.203: v32.09,3.74 32.26,3.56 32.98,3.56 C17.P$1 | v38.84,3.38 38.13,2.67 R17.P$2 | v28.71,33.25 22.13,33.25 U$247.14 | v40.09,21.88 54.13,21.88 55.38,20.63 v55.38,7.3
  Bottom 0.203: v32.09,3.74 32.44,3.74 33.33,2.85 36.35,2.85 37.07,3.56 F17.P$2 37.24,3.56 37.42,3.38 v38.84,3.38 38.84,2.32 39.55,1.61 43.82,1.61 44.18,1.96 50.76,1.96 51.11,2.32 52.89,2.32 54.85,4.27 54.85,4.45 55.38,4.98 v55.38,7.3 | v40.09,21.88 v28.71,33.25
CH18  (via drill 0.35)
  Top 0.203: v24.62,6.58 24.98,6.23 25.51,6.23 C18.P$1 | v31.2,4.98 31.02,4.98 30.49,4.45 R18.P$2 | v20.71,33.43 21.06,33.79 21.95,33.79 U$247.15 | v22.49,22.59 22.49,13.34 v25.15,10.67
  Bottom 0.203: v31.2,4.98 30.49,4.98 29.95,5.52 F18.P$2 29.78,5.52 29.42,5.16 26.04,5.16 v24.62,6.58 25.15,7.12 v25.15,10.67 | v20.71,33.43 20.71,32.9 22.49,31.12 v22.49,22.59
CH19  (via drill 0.35)
  Top 0.203: v18.04,10.85 18.4,10.5 18.75,10.5 C19.P$1 | v24.09,8.01 23.73,7.65 23.37,7.65 R19.P$2 | v20.53,32.01 21.95,32.01 U$247.12 | v18.4,29.52 14.84,29.52 8.44,23.12 v7.91,23.12
  Bottom 0.203: v24.09,8.01 23.73,8.01 22.84,8.9 F19.P$2 22.66,8.9 20,8.9 v18.04,10.85 16.8,10.85 11.82,15.83 10.4,15.83 7.73,18.5 7.73,22.41 7.91,22.59 v7.91,23.12 | v20.53,32.01 20.53,31.65 v18.4,29.52
CH20  (via drill 0.35)
  Top 0.203: v12.35,16.36 12.53,16.36 13.06,15.83 C20.P$1 | v17.86,12.45 17.69,12.27 16.97,12.27 R20.P$2 | v8.26,32.19 10.57,34.5 16.26,34.5 U$247.1
  Bottom 0.203: v17.86,12.45 16.8,13.52 F20.P$2 16.62,13.7 14.66,13.7 12.35,16.01 v12.35,16.36 10.4,16.36 8.08,18.68 8.08,22.23 9.33,23.48 9.33,27.74 7.55,29.52 7.55,30.41 8.26,31.12 v8.26,32.19
CH21  (via drill 0.35)
  Top 0.203: C21.P$1 8.44,22.05 8.44,19.74 10.04,18.14 v10.22,18.14 11.28,18.14 R21.P$2 | v8.26,30.05 10.22,32.01 16.26,32.01 U$247.5
  Bottom 0.203: v8.26,30.05 8.26,29.34 10.04,27.57 10.04,23.83 11.64,22.23 11.64,19.39 F21.P$2 11.46,19.39 v10.22,18.14
CH22  (via drill 0.35)
  Top 0.203: v4.88,30.23 5.06,30.05 5.06,29.34 C22.P$1 | R22.P$2 7.2,24.54 v8.26,24.54 8.44,24.36 9.15,24.36 11.64,26.85 v11.64,30.59 | v14.31,33.25 14.84,33.79 16.26,33.79 U$247.2
  Bottom 0.203: v4.88,30.23 4.88,28.1 6.84,26.14 7.55,26.14 F22.P$2 7.73,25.97 8.26,25.43 v8.26,24.54 | v11.64,30.59 v14.31,33.25
CH23  (via drill 0.35)
  Top 0.203: 7.2,32.19 7.2,36.46 5.42,38.23 4.88,38.23 3.64,36.99 3.28,36.99 C23.P$1 | 7.2,32.19 6.48,31.48 v5.42,31.48 5.06,31.48 4.53,32.01 R23.P$2 | 7.2,32.19 7.91,31.48 8.62,31.48 9.68,32.54 16.26,32.54 U$247.4
  Bottom 0.203: v5.42,31.48 5.24,31.65 5.24,33.25 F23.P$2
CH24  (via drill 0.35)
  Top 0.203: v2.93,45.88 2.93,44.99 C24.P$1 | R24.P$2 3.28,39.66 v3.28,38.77 3.46,38.59 5.42,38.59 12.17,45.35 v12.17,57.26 | v11.82,59.21 16.62,64.01 30.31,64.01 U$281.13
  Bottom 0.203: v2.93,45.88 2.93,45.17 2.75,44.99 2.75,42.14 3.99,40.9 F24.P$2 3.99,40.72 3.28,40.01 v3.28,38.77 | v11.82,59.21 11.82,57.61 v12.17,57.26
CH25  (via drill 0.35)
  Top 0.203: 4.53,53.35 4.53,52.64 C25.P$1 | v4.17,46.95 3.99,46.95 3.46,47.48 R25.P$2 | 4.53,53.35 7.02,53.35 17.15,63.48 30.31,63.48 U$281.14 | 4.53,53.35 v4.71,53.52
  Bottom 0.203: v4.71,53.52 3.46,52.28 3.46,49.43 4.35,48.55 F25.P$2 4.35,48.37 4.17,48.19 v4.17,46.95
CH26  (via drill 0.35)
  Top 0.203: v7.37,60.99 7.2,60.81 7.2,60.1 C26.P$1 | v5.77,54.59 5.77,54.77 5.24,55.3 R26.P$2 | v15.02,59.92 20.71,59.92 23.55,62.77 30.31,62.77 U$281.15
  Bottom 0.203: v5.77,54.59 5.77,55.3 6.31,55.84 F26.P$2 6.31,56.01 5.95,56.37 5.95,59.57 v7.37,60.99 8.44,59.92 v15.02,59.92
CH27  (via drill 0.35)
  Top 0.203: C27.P$1 11.11,66.68 9.86,66.68 8.44,65.26 v8.44,63.84 8.44,62.59 R27.P$2 | v13.42,64.73 30.31,64.73 U$281.12
  Bottom 0.203: v13.42,64.73 12.88,64.73 11.11,62.95 9.86,62.95 F27.P$2 9.68,62.95 8.8,63.84 v8.44,63.84
CH28  (via drill 0.35)
  Top 0.203: v17.33,73.44 16.62,72.73 C28.P$1 | v13.24,67.93 13.06,68.1 13.06,68.81 R28.P$2 | v34.75,62.24 36,62.24 U$281.1 | v28.35,72.02 21.95,72.02 21.24,71.3 v19.46,71.3
  Bottom 0.203: v13.24,67.93 14.31,68.99 F28.P$2 14.48,69.17 14.48,71.13 16.8,73.44 v17.33,73.44 v19.46,71.3 | v34.75,62.24 34.75,63.84 35.29,64.37 35.29,69.35 32.62,72.02 v28.35,72.02
CH29  (via drill 0.35)
  Top 0.203: v23.73,77.7 23.37,77.35 23.02,77.35 C29.P$1 | v18.75,73.44 18.75,74.15 R29.P$2 | v34.58,64.73 36,64.73 U$281.5 | v33.51,59.39 v33.51,63.66
  Bottom 0.203: v23.73,77.7 22.31,77.7 20.17,75.57 20.17,74.33 F29.P$2 20,74.15 19.29,73.44 v18.75,73.44 18.04,74.15 16.97,74.15 7.73,64.9 7.73,62.77 10.22,60.28 14.31,60.28 15.2,61.17 25.51,61.17 26.58,60.1 26.58,58.86 26.22,58.5 25.15,58.5 24.44,57.79 24.44,55.12 25.15,54.41 25.86,54.41 30.84,59.39 v33.51,59.39 | v33.51,63.66 v34.58,64.73
CH30  (via drill 0.35)
  Top 0.203: v31.02,80.91 30.84,80.73 30.13,80.73 C30.P$1 | v25.33,77.53 25.33,78.42 R30.P$2 | v33.51,64.73 35.29,62.95 36,62.95 U$281.2 | v29.6,68.99 29.6,71.84 v26.04,75.39
  Bottom 0.203: v31.02,80.91 28.89,80.91 26.93,78.95 26.93,78.24 F30.P$2 | 26.04,77.53 26.22,77.53 26.75,78.06 F30.P$2 | 26.04,77.53 v25.33,77.53 | v33.51,64.73 33.51,65.08 v29.6,68.99 | 26.04,77.53 v26.04,75.39 | 26.04,77.53 F30.P$2
CH31  (via drill 0.35)
  Top 0.203: v38.84,82.33 37.78,82.33 C31.P$1 | v32.44,80.37 32.62,80.55 32.62,81.26 R31.P$2 | v34.22,77.88 37.24,74.86 37.24,64.55 36.89,64.19 36.18,64.19 U$281.4
  Bottom 0.203: v38.84,82.33 38.31,82.33 37.95,82.68 36,82.68 34.04,80.73 F31.P$2 | v32.44,80.37 33.69,80.37 33.87,80.55 F31.P$2 | v34.22,77.88 34.22,80.37 34.04,80.55 F31.P$2
D2  (via drill 0.35)
  Top 0.203: 28.71,53.7 25.86,56.55 25.15,56.55 20.35,51.75 20.35,34.14 19.82,33.61 19.82,31.65 20.17,31.3 21.95,31.3 U$247.11 | 28.71,53.7 31.38,51.03 31.38,50.15 U$1.P$1 | v44.18,62.59 40.62,59.04 40.62,58.32 U2.32 | v48.98,65.08 49.33,65.08 49.69,65.44 50.4,65.44 U$179.11 | v29.06,65.44 30.31,65.44 U$281.11 | v68,32.9 69.43,31.48 70.14,31.48 U$213.11 | v28.89,53.7 28.71,53.7
  Bottom 0.203: 46.49,62.59 44.36,62.59 | v48.98,65.08 46.49,62.59 | v29.06,65.44 29.06,64.9 34.58,59.39 | 34.58,59.39 36.53,57.44 39.2,57.44 44.36,62.59 | 44.36,62.59 v44.18,62.59 | v68,32.9 68,41.08 46.49,62.59 | 34.58,59.39 v28.89,53.7
D3  (via drill 0.35)
  Top 0.203: v28.89,50.15 26.4,50.15 U$2.P$1 | v37.6,56.37 37.95,56.37 38.31,56.72 | 38.31,56.72 38.84,56.72 U2.1 38.31,56.72 | v23.55,31.12 23.2,30.77 22.13,30.77 U$247.10 | v29.06,66.5 29.42,66.15 30.31,66.15 U$281.10 | 38.31,56.72 v36.89,58.15 | v68.89,30.77 70.14,30.77 U$213.10 | v52.18,63.48 52.18,64.19 52.53,64.55 52.53,65.26 51.82,65.97 50.58,65.97 U$179.10 50.4,66.15 49.69,66.15 49.33,66.5 v48.98,66.5
  Bottom 0.203: v37.6,56.37 31.38,50.15 v28.89,50.15 23.55,44.81 v23.55,31.12 | v29.06,66.5 32.44,63.13 32.44,62.06 36.35,58.15 v36.89,58.15 37.95,58.15 38.31,57.79 39.02,57.79 40.27,59.04 40.27,60.81 45.96,66.5 v48.98,66.5 | v68.89,30.77 68.89,43.57 52.18,60.28 v52.18,63.48
D4  (via drill 0.35)
  Top 0.203: v23.73,50.15 21.42,50.15 U$3.P$1 | U2.2 38.84,55.84 38.13,55.84 37.78,55.48 36.18,55.48 35.82,55.84 v35.11,55.84 v35.11,60.46 v40.98,60.46 | v23.37,30.05 22.13,30.05 U$247.9 | v29.95,67.57 30.31,67.21 30.31,66.86 U$281.9 | v62.31,51.21 67.29,46.23 67.29,30.94 68.54,29.7 69.25,29.7 69.6,30.05 70.14,30.05 U$213.9 | v50.22,67.57 50.22,67.04 50.4,66.86 U$179.9
  Bottom 0.203: v35.11,55.84 33.51,55.84 27.82,50.15 v23.73,50.15 22.84,49.26 22.84,30.59 v23.37,30.05 | v29.95,67.57 29.95,66.33 32.8,63.48 32.8,62.77 v35.11,60.46 | v62.31,51.21 62.31,51.75 52.89,61.17 52.89,64.19 | 52.89,64.19 52.89,64.9 v50.22,67.57 | v40.98,60.46 46.31,65.79 49.87,65.79 51.47,64.19 52.89,64.19
D5  (via drill 0.35)
  Top 0.203: v40.62,48.19 40.62,49.61 U2.9 | v40.8,54.24 40.8,56.37 v38.67,58.5 | v38.67,70.95 38.67,76.28 v38.31,76.64
  Bottom 0.203: v40.62,48.19 40.62,54.06 v40.8,54.24 | v38.67,70.95 v38.67,58.5 | v38.31,76.64 37.78,76.64 37.24,77.17 U$346.P$4
GND  (via drill 0.35)
  Top 0.203: v42.93,38.59 42.93,46.23 U$280.P$2 | S2.4 56.8,45.35 60,45.35 60.54,45.88 61.6,45.88 61.78,45.7 61.78,36.99 59.82,35.03 U$6.P$5 59.82,34.86 59.82,34.5 62.85,31.48 64.45,31.48 U$213.6 64.62,31.3 64.62,30.77 U$213.7 64.62,30.59 64.62,30.23 U$213.8 64.62,30.05 66.05,28.63 67.65,28.63 U$246.P$2 67.82,28.45 74.05,22.23 | VR8.P$3 81.16,41.61 81.52,41.26 81.52,40.19 C8.P$2 81.52,40.01 79.56,38.06 79.56,35.39 80.09,34.86 80.09,34.5 VR9.P$3 80.27,34.32 80.27,32.9 C9.P$2 80.45,32.9 81.87,32.9 82.05,33.08 82.76,33.08 83.12,32.72 83.12,32.01 82.4,31.3 79.56,31.3 77.43,29.17 77.43,27.74 77.78,27.39 VR10.P$3 77.96,27.21 77.96,25.79 C10.P$2 77.78,25.61 77.43,25.61 74.05,22.23 | 74.05,22.23 74.05,21.16 74.23,20.99 VR11.P$3 74.23,20.81 73.87,20.45 73.87,19.39 C11.P$2 73.69,19.21 72.45,19.21 69.43,16.19 69.43,15.3 VR12.P$3 69.43,15.12 68.71,14.41 68.71,13.87 C12.P$2 68.54,13.7 68.18,13.7 67.47,12.99 65.16,12.99 63.74,11.56 63.74,10.67 VR13.P$3 63.74,10.5 62.67,9.43 C13.P$2 62.49,9.25 58.4,9.25 57.16,8.01 57.16,7.3 VR14.P$3 56.98,7.3 55.91,6.23 C14.P$2 55.73,6.23 55.38,6.58 50.93,6.58 50.04,5.7 50.04,5.34 VR15.P$3 49.87,5.16 49.33,4.63 48.62,4.63 C15.P$2 48.44,4.63 47.56,5.52 43.29,5.52 42.58,4.81 VR16.P$3 42.4,4.63 42.04,4.27 40.98,4.27 C16.P$2 40.8,4.27 39.73,4.27 37.78,6.23 35.82,6.23 35.29,5.7 VR17.P$3 35.11,5.52 33.51,5.52 C17.P$2 33.33,5.52 32.62,5.52 29.78,8.36 28.53,8.36 28.18,8.01 VR18.P$3 28,8.01 26.4,8.01 C18.P$2 26.22,8.19 26.22,8.54 23.02,11.74 21.95,11.74 21.77,11.56 VR19.P$3 21.6,11.56 21.24,11.92 20.17,11.92 C19.P$2 20,12.1 20,13.34 16.97,16.36 16.09,16.36 VR20.P$3 15.91,16.36 15.2,17.08 14.66,17.08 C20.P$2 14.48,17.25 13.95,17.79 13.95,20.45 12.53,21.88
  Top 0.203: 8.08,28.81 7.02,29.88 C22.P$2 | 16.26,31.3 16.26,30.77 U$247.7 16.26,30.59 16.26,30.23 U$247.8 16.44,30.23 18.75,30.23 19.29,29.7 19.29,28.63 U$212.P$2 19.29,28.45 12.71,21.88 12.53,21.88 | 8.08,28.81 8.8,28.81 11.28,31.3 16.26,31.3 | 8.08,28.81 VR22.P$3 | 16.26,31.3 U$247.6 | C21.P$2 10.22,23.12 11.28,22.05 VR21.P$3 11.46,22.05 12.35,22.05 12.53,21.88 | C7.P$2 81.16,47.66 81.16,48.55 80.63,49.08 VR7.P$3 80.45,49.26 80.09,49.26 79.38,49.97 79.38,54.77 C6.P$2 79.38,54.95 79.38,55.48 78.67,56.19 VR6.P$3 78.49,56.37 77.78,56.37 76.54,57.61 76.54,61.53 C5.P$2 76.36,61.7 75.29,62.77 VR5.P$3 75.11,62.95 74.23,62.95 72.09,65.08 72.09,67.75 C4.P$2 71.91,67.93 71.38,67.93 70.67,68.64 VR4.P$3 70.49,68.64 69.6,68.64 66.58,71.66 66.58,72.9 C3.P$2 66.4,73.08 65.34,73.08 64.98,73.44 VR3.P$3 64.8,73.44 64.62,73.26 63.56,73.26 62.67,74.15 62.67,74.33 60.18,76.82 C2.P$2 60,76.99 58.58,76.99 VR2.P$3 58.4,76.99 57.87,76.99 57.51,76.64 55.91,76.64 53.25,79.31 C1.P$2 53.07,79.48 51.47,79.48 VR1.P$3 51.29,79.31 46.31,74.33 45.42,74.33 43.29,76.46 43.29,79.48 | X1.3 X1.4 25.51,47.12 26.22,46.41 2.K | 4.K 21.42,46.23 23.2,46.23 24.09,45.35 25.33,45.35 26.22,46.23 2.K | 2.K 26.4,46.23 27.29,45.35 30.49,45.35 31.38,46.23 1.K 31.55,46.41 31.55,48.9 35.47,52.81 | 40.09,53.88 39.91,53.7 39.02,53.7 U2.5 | 40.09,53.88 40.09,54.77 39.73,55.12 39.02,55.12 U2.3 38.84,55.12 35.29,55.12 34.93,54.77 | 35.47,52.81 35.11,52.81 34.4,53.52 34.4,54.24 34.93,54.77 | 35.47,52.81 35.64,52.81 Y2.2 35.47,52.81 | U$176.P$2 53.25,67.75 55.2,67.75 56.09,66.86 U$179.8 56.09,66.68 56.09,66.15 U$179.7 56.09,65.97 56.09,65.61 U$179.6 56.27,65.44 57.69,65.44 58.22,64.9 58.22,57.79 54.49,54.06 LED4.K 54.31,53.88 53.96,53.88 53.07,52.99
  Top 0.203: 53.07,52.99 49.69,52.99 48.44,54.24 47.73,54.24 U2.21 47.56,54.24 46.84,54.24 46.13,53.52 40.44,53.52 40.09,53.88 | 53.07,52.99 53.42,52.64 53.42,46.95 52.71,46.23 52.71,45.35 S2.3 52.53,45.17 51.47,44.1 48.44,44.1 U$177.P$2 48.27,43.92 48.27,35.57 40.8,28.1 U$5.P$2 | U$281.6 36.18,65.61 36.18,65.97 U$281.7 36.18,66.15 36.18,66.68 U$281.8 36,66.86 35.11,67.75 32.98,67.75 U$314.P$2 | C0.P$2 45.6,80.73 44.53,80.73 44.18,80.37 VR0.P$3 44,80.19 43.29,79.48 | 43.29,79.48 39.02,79.48 38.13,80.37 C31.P$2 37.95,80.37 37.24,80.37 36.71,79.84 VR31.P$3 36.53,79.66 36.53,79.31 35.64,78.42 34.75,78.42 34.58,78.59 32.44,78.59 | 32.44,78.59 31.02,78.59 C30.P$2 30.84,78.59 30.31,78.59 29.6,77.88 VR30.P$3 29.42,77.7 29.42,76.99 28.53,76.1 24.44,76.1 24.09,75.75 C29.P$2 23.91,75.57 22.84,74.5 VR29.P$3 22.84,74.33 22.84,73.44 21.42,72.02 18.75,72.02 18.04,71.3 C28.P$2 17.86,71.13 17.86,70.59 17.15,69.88 VR28.P$3 17.15,69.7 17.15,68.81 14.13,65.79 12.88,65.79 C27.P$2 12.71,65.61 12.71,64.55 12.35,64.19 VR27.P$3 12.35,64.01 12.53,63.84 12.53,62.77 11.46,61.7 11.28,61.7 8.97,59.39 C26.P$2 8.8,59.21 8.8,57.79 VR26.P$3 8.8,57.61 9.15,57.26 9.15,56.01 6.84,53.7 5.59,53.7 5.06,54.24 4.35,54.24 3.64,53.52 3.64,52.1 3.99,51.75 6.31,51.75 | 32.44,78.59 32.44,77.53 32.8,77.17 32.8,67.93 U$314.P$2 | 5.24,36.63 5.24,37.34 C23.P$2 | 5.24,36.63 5.95,35.92 VR23.P$3 | 6.31,51.75 6.31,50.68 VR25.P$3 6.48,50.5 6.48,50.15 7.02,49.61 7.02,46.77 5.24,44.99 C24.P$2 5.24,44.81 5.24,43.57 5.42,43.39 VR24.P$3 5.59,43.21 6.31,42.5 6.31,40.01 5.24,38.94 4.53,38.94 4.35,39.12 4.35,39.83 3.46,40.72 2.93,40.72 2.57,40.37 2.57,36.46 2.93,36.1 3.64,36.1 4.17,36.63 5.24,36.63
  Top 0.203: 6.31,51.75 6.31,52.1 C25.P$2 | 34.93,54.77 32.8,56.9 32.8,67.75 U$314.P$2
  Bottom 0.203: U$342.P$3 13.42,61.53 13.42,62.41 13.06,62.77 13.06,63.13 16.8,66.86 17.69,66.86 U$343.P$3 | U$343.P$3 17.69,67.04 17.69,68.46 19.46,70.24 21.95,70.24 23.02,71.3 U$344.P$3 23.02,71.48 23.02,72.73 24.44,74.15 28.53,74.15 29.06,74.68 U$345.P$3 29.24,74.86 29.24,75.93 30.13,76.82 35.64,76.82 U$346.P$3 35.82,76.82 36.71,75.93 40.62,75.93 42.4,77.7 U$315.P$3 42.4,77.88 43.47,78.95 45.24,78.95 46.84,77.35 49.33,77.35 U$316.P$3 49.51,77.35 50.4,78.24 51.47,78.24 54.31,75.39 55.91,75.39 U$317.P$3 56.09,75.39 56.8,76.1 58.05,76.1 61.78,72.37 62.14,72.37 U$318.P$3 62.31,72.37 63.2,72.37 63.56,72.73 63.91,72.73 67.65,68.99 67.65,68.1 U$319.P$3 67.82,68.1 69.25,68.1 69.96,67.39 69.96,64.9 72.09,62.77 U$320.P$3 72.27,62.59 73.69,62.59 75.47,60.81 75.47,56.72 U$321.P$3 75.65,56.55 76.71,56.55 77.6,55.66 77.6,50.15 U$322.P$3 77.78,49.97 78.49,49.97 79.38,49.08 79.38,44.1 78.67,43.39 | U$341.P$3 10.4,55.12 7.55,52.28 7.55,49.61 8.44,48.72 U$340.P$3 8.44,48.55 8.44,45.35 6.84,43.75 6.84,42.68 7.91,41.61 | 7.91,41.61 7.91,37.34 7.2,36.63 7.2,35.92 8.08,35.03 8.8,35.03 U$338.P$3 8.97,34.86 8.97,29.34 9.86,28.45 10.93,28.45 U$337.P$3 11.11,28.28 11.11,24.19 12.88,22.41 14.31,22.41 U$336.P$3 14.48,22.23 14.48,19.74 17.33,16.9 18.75,16.9 U$335.P$3 18.93,16.9 18.93,15.83 22.49,12.27 23.91,12.27 24.26,12.63 U$334.P$3 24.44,12.63 24.8,12.63 28.53,8.9 29.78,8.9 30.49,9.61 U$333.P$3 30.66,9.61 33.51,6.76 36.18,6.76 37.07,7.65 U$332.P$3 37.24,7.65 40.44,7.65 42.04,6.05 43.11,6.05 44.18,7.12 | 7.91,41.61 U$339.P$3 | 44.18,7.12 48.44,7.12 49.16,6.41 49.87,6.41 50.76,7.3 50.76,8.01 U$330.P$3 50.93,8.19 56.45,8.19 57.33,9.07 57.33,10.14 U$329.P$3 57.51,10.32 60.36,10.32 61.42,11.39 62.67,11.39 63.56,12.27 63.56,13.52 U$328.P$3 63.56,13.7 65.69,15.83 68.18,15.83 68.89,16.54 68.89,17.96 U$327.P$3 68.89,18.14 69.78,18.14 73.51,21.88 73.51,23.12 73.16,23.48 U$326.P$3 73.16,23.65 73.16,24.01 76.89,27.74 76.89,28.99 76.18,29.7 U$325.P$3 76.18,29.88 76.18,30.23 79.03,33.08 79.03,35.39 78.14,36.28 U$324.P$3 78.14,36.46 78.14,39.66 79.74,41.26 79.74,42.32 78.67,43.39
  Bottom 0.203: 44.18,7.12 U$331.P$3 | 78.67,43.39 U$323.P$3 | 42.93,36.63 42.93,30.23 40.8,28.1 U$5.P$2 | 42.93,36.63 v42.93,38.59 | 42.93,36.63 58.05,36.63 U$6.P$5 | U$343.P$3 17.86,66.86 18.93,66.86 24.26,61.53 25.69,61.53 26.93,60.28 26.93,56.9 X1.3
  pour Top: -13.86,83.14 -13.86,15.83 2.65,-0.68 6.46,-4.49 62.34,-4.49 71.23,-4.49 94.09,18.37 94.09,74.25 90.28,74.25 80.12,84.41 61.07,84.41 57.26,88.22 -8.78,88.22
  pour Bottom: -11.32,94.57 -13.86,92.03 -13.86,-3.22 -10.05,-7.03 59.8,-7.03 75.04,-7.03 101.71,19.64 101.71,64.09 71.23,94.57
MISO
  Top 0.203: U2.16 45.96,49.61 45.96,35.74 44.36,34.14 40.8,34.14 U$5.P$5
MOSI
  Top 0.203: U2.15 45.24,49.61 45.24,35.57 44.71,35.03 40.44,35.03 39.73,34.32 39.73,32.9 40.62,32.01 U$5.P$4
N$1
  Top 0.203: U$3.P$2 19.64,49.97 19.64,46.41 4.A
N$2
  Top 0.203: U$2.P$2 24.62,46.41 2.A
N$3
  Top 0.203: U$1.P$2 29.78,49.97 29.78,46.41 1.A
N$4
  Top 0.203: U$4.P$2 52.53,57.61 52.53,54.06 LED4.A
N$51
  Top 0.203: U$177.P$1 48.44,46.06 48.44,48.72 48.98,49.26 48.98,52.81 48.27,53.52 47.73,53.52 U2.20
N$69
  Top 0.203: U$175.P$2 61.07,38.77 57.33,35.03 U$6.P$4
N$70
  Top 0.203: U2.31 41.33,58.15 41.33,56.9 42.58,55.66 45.07,55.66 46.67,57.26 46.67,70.95 45.6,72.02 45.6,72.73 45.96,73.08 51.29,73.08 58.58,65.79 58.58,51.75 53.78,46.95 53.78,36.63 52.18,35.03 U$6.P$2
N$78  (via drill 0.35)
  Top 0.203: v42.76,59.57 42.22,59.04 42.22,58.32 U2.30
  Bottom 0.203: v42.76,59.57 46.84,59.57 63.02,43.39 63.02,34.5 62.14,33.61 56.09,33.61 54.85,34.86 U$6.P$3
N$79
  Top 0.203: U2.7 38.84,52.1 37.78,52.1 36.18,53.7 35.82,53.7 Y2.1
N$81
  Top 0.203: U2.8 38.84,51.21 36,51.21 35.82,51.39 Y2.3
N$83
  Top 0.203: 42.04,80.73 40.62,80.73 R0.P$1 | 42.04,80.73 42.4,80.37 VR0.P$2 42.04,80.73 | VR0.P$1 43.29,81.97 42.04,80.73
N$84
  Top 0.203: 49.16,80.55 48.27,80.55 R1.P$1 | 49.16,80.55 49.87,79.84 VR1.P$2 | 49.16,80.55 49.33,80.55 51.11,82.33 VR1.P$1
N$85
  Top 0.203: 56.8,78.06 56.98,77.88 VR2.P$2 56.8,78.06 | 56.8,78.06 56.09,78.77 55.56,78.77 R2.P$1 | 56.8,78.06 58.76,80.02 VR2.P$1
N$86
  Top 0.203: 63.74,74.5 62.49,75.75 R3.P$1 | 63.74,74.5 65.51,76.28 65.87,76.28 VR3.P$1 | 63.74,74.5 VR3.P$2
N$87
  Top 0.203: R4.P$1 68.54,71.3 68.54,70.77 69.43,69.88 VR4.P$2 69.6,69.88 70.85,71.13 71.91,71.13 VR4.P$1
N$88
  Top 0.203: R5.P$1 73.69,65.97 73.69,64.73 74.23,64.19 VR5.P$2 74.4,64.19 75.29,65.08 77.07,65.08 VR5.P$1
N$89
  Top 0.203: 77.78,58.15 77.78,57.79 VR6.P$2 77.78,58.15 | 77.78,58.15 77.78,59.57 R6.P$1 | 77.78,58.15 80.8,58.15 VR6.P$1
N$90
  Top 0.203: R7.P$1 80.27,52.46 80.27,50.68 VR7.P$2 80.27,50.5 83.12,50.5 VR7.P$1
N$92
  Top 0.203: 81.52,43.75 81.52,45.17 R8.P$1 | 81.52,43.75 81.16,43.39 VR8.P$2 81.52,43.75 | VR8.P$1 82.76,42.5 81.52,43.75
N$93
  Top 0.203: 81.16,36.63 80.63,36.1 VR9.P$2 | 81.16,36.63 81.34,36.81 81.34,37.52 R9.P$1 | 81.16,36.63 83.12,34.68 VR9.P$1
N$94
  Top 0.203: 78.85,28.99 78.67,28.81 VR10.P$2 78.85,28.99 | 78.85,28.99 79.56,29.7 79.56,30.23 R10.P$1 | 78.85,28.99 80.8,27.03 VR10.P$1
N$95
  Top 0.203: 75.29,22.05 76.54,23.3 R11.P$1 | 75.29,22.05 77.07,20.28 77.07,19.92 VR11.P$1 | 75.29,22.05 VR11.P$2
N$96
  Top 0.203: R12.P$1 72.09,17.08 71.38,17.08 70.67,16.36 VR12.P$2 70.67,16.19 71.91,14.94 71.91,13.87 VR12.P$1
N$97
  Top 0.203: 65.87,11.92 65.34,11.92 64.98,11.56 VR13.P$2 | 65.87,11.92 66.76,11.92 R13.P$1 | 65.87,11.92 65.87,8.72 VR13.P$1
N$98
  Top 0.203: 58.93,8.01 58.58,8.01 VR14.P$2 58.93,8.01 | 58.93,8.01 60.36,8.01 R14.P$1 | 58.93,8.01 58.93,4.98 VR14.P$1
N$99
  Top 0.203: R15.P$1 53.42,5.52 51.47,5.52 VR15.P$2 51.29,5.52 51.29,2.67 VR15.P$1
N$101
  Top 0.203: 44.53,4.27 45.96,4.27 R16.P$1 | 44.53,4.27 44.18,4.63 VR16.P$2 44.53,4.27 | VR16.P$1 43.29,3.03 44.53,4.27
N$102
  Top 0.203: 37.24,4.63 36.71,5.16 VR17.P$2 | 37.24,4.63 37.42,4.45 38.31,4.45 R17.P$1 | 37.24,4.63 37.24,4.45 35.47,2.67 VR17.P$1
N$103
  Top 0.203: 29.78,6.94 29.6,7.12 VR18.P$2 29.78,6.94 | 29.78,6.94 30.66,6.05 31.02,6.05 R18.P$1 | 29.78,6.94 27.82,4.98 VR18.P$1
N$104
  Top 0.203: R19.P$1 24.09,9.25 24.09,9.61 23.02,10.67 VR19.P$2 22.84,10.85 20.71,8.72 VR19.P$1
N$105
  Top 0.203: R20.P$1 18.04,13.52 18.04,14.23 17.15,15.12 VR20.P$2 16.97,15.12 15.73,13.87 14.66,13.87 VR20.P$1
N$106
  Top 0.203: 12.71,19.92 12.71,20.45 12.35,20.81 VR21.P$2 | 12.71,19.92 12.71,19.03 R21.P$1 | 12.71,19.92 9.51,19.92 VR21.P$1
N$107
  Top 0.203: 8.8,27.03 8.8,27.21 VR22.P$2 8.8,27.03 | 8.8,27.03 8.8,25.43 R22.P$1 | 8.8,27.03 5.77,27.03 VR22.P$1
N$108
  Top 0.203: R23.P$1 6.31,32.54 6.31,34.32 VR23.P$2 6.31,34.5 3.46,34.5 VR23.P$1
N$110
  Top 0.203: 5.06,41.26 5.06,39.83 R24.P$1 | 5.06,41.26 5.42,41.61 VR24.P$2 5.06,41.26 | VR24.P$1 3.82,42.5 5.06,41.26
N$111
  Top 0.203: 5.42,48.55 5.95,49.08 VR25.P$2 | 5.42,48.55 5.24,48.37 5.24,47.48 R25.P$1 | 5.42,48.55 5.24,48.55 3.46,50.32 VR25.P$1
N$112
  Top 0.203: 7.73,56.01 7.91,56.19 VR26.P$2 7.73,56.01 | 7.73,56.01 6.84,55.12 6.84,54.77 R26.P$1 | 7.73,56.01 5.77,57.97 VR26.P$1
N$113
  Top 0.203: 11.28,62.95 10.04,61.7 R27.P$1 | 11.28,62.95 9.51,64.73 9.51,65.08 VR27.P$1 | 11.28,62.95 VR27.P$2
N$114
  Top 0.203: R28.P$1 14.31,67.75 15.02,67.75 15.91,68.64 VR28.P$2 15.91,68.81 14.66,70.06 14.66,71.13 VR28.P$1
N$115
  Top 0.203: R29.P$1 19.64,72.9 21.06,72.9 21.6,73.44 VR29.P$2 21.6,73.62 20.71,74.5 20.71,76.28 VR29.P$1
N$116
  Top 0.203: 27.82,76.99 28,76.99 VR30.P$2 27.82,76.99 | 27.82,76.99 26.22,76.99 R30.P$1 | 27.82,76.99 27.82,80.02 VR30.P$1
N$117
  Top 0.203: R31.P$1 33.15,79.48 35.11,79.48 VR31.P$2 35.29,79.48 35.29,82.33 VR31.P$1
N$118
  Bottom 0.203: U$315.P$4 44.18,77.7 48.44,73.44 48.44,72.37 U$316.P$2
N$119
  Bottom 0.203: U$316.P$4 50.93,76.82 50.93,73.97 54.13,70.77 U$317.P$2
N$120
  Bottom 0.203: U$320.P$2 68.18,59.92 68.18,66.33 68.71,66.86 U$319.P$4
N$121
  Bottom 0.203: U$321.P$2 71.03,54.95 71.03,59.39 72.98,61.35 U$320.P$4
N$122
  Bottom 0.203: U$322.P$2 72.98,49.26 72.98,52.1 76,55.12 U$321.P$4
N$123
  Bottom 0.203: U$317.P$4 57.51,74.68 57.51,70.06 59.47,68.1 U$318.P$2
N$124
  Bottom 0.203: U$318.P$4 63.56,71.3 63.56,65.08 64.09,64.55 U$319.P$2
N$125
  Bottom 0.203: U$324.P$2 73.16,37.52 74.4,37.52 78.49,41.61 U$323.P$4
N$126
  Bottom 0.203: U$325.P$2 71.56,31.65 74.4,31.65 77.6,34.86 U$324.P$4
N$127
  Bottom 0.203: U$328.P$2 60.89,17.61 67.11,17.61 67.65,17.08 U$327.P$4
N$128
  Bottom 0.203: U$329.P$2 55.73,14.76 60.18,14.76 62.14,12.81 U$328.P$4
N$129
  Bottom 0.203: U$330.P$2 50.04,12.81 52.89,12.81 55.91,9.79 U$329.P$4
N$130
  Bottom 0.203: U$326.P$2 68.89,26.5 73.69,26.5 75.47,28.28 U$325.P$4
N$131
  Bottom 0.203: U$327.P$2 65.34,21.7 71.56,21.7 72.09,22.23 U$326.P$4
N$132
  Bottom 0.203: U$331.P$4 42.4,7.3 42.4,8.36 38.13,12.63 U$332.P$2
N$133
  Bottom 0.203: U$332.P$4 35.64,8.19 35.64,11.03 32.44,14.23 U$333.P$2
N$134
  Bottom 0.203: U$335.P$4 17.86,18.14 17.86,24.54 18.4,25.08 U$336.P$2
N$135
  Bottom 0.203: U$336.P$4 13.6,23.65 13.6,28.1 15.55,30.05 U$337.P$2
N$136
  Bottom 0.203: U$337.P$4 10.57,29.88 10.57,32.72 13.6,35.74 U$338.P$2
N$137
  Bottom 0.203: U$333.P$4 29.06,10.32 29.06,14.94 27.11,16.9 U$334.P$2
N$138
  Bottom 0.203: U$334.P$4 23.02,13.7 23.02,19.92 22.49,20.45 U$335.P$2
N$139
  Bottom 0.203: U$339.P$4 8.08,43.39 9.33,43.39 13.42,47.48 U$340.P$2
N$140
  Bottom 0.203: U$340.P$4 8.97,50.15 11.82,50.15 15.02,53.35 U$341.P$2
N$141
  Bottom 0.203: U$344.P$2 25.69,67.39 19.46,67.39 18.93,67.93 U$343.P$4
N$142
  Bottom 0.203: U$345.P$2 30.84,70.24 26.4,70.24 24.44,72.19 U$344.P$4
N$143
  Bottom 0.203: U$346.P$2 36.53,72.19 35.29,72.19 32.26,75.22 30.66,75.22 U$345.P$4
N$144
  Bottom 0.203: U$341.P$4 11.11,56.55 15.73,56.55 17.69,58.5 U$342.P$2
N$145
  Bottom 0.203: U$342.P$4 14.48,62.77 20.71,62.77 21.24,63.3 U$343.P$2
N$146
  Bottom 0.203: U$323.P$2 73.69,43.39 73.69,44.28 77.96,48.55 U$322.P$4
N$147
  Bottom 0.203: U$330.P$4 49.33,7.83 48.44,7.83 44.18,12.1 U$331.P$2
N$148
  Bottom 0.203: U$338.P$4 8.62,36.46 8.62,37.34 12.88,41.61 U$339.P$2
RES  (via drill 0.35)
  Top 0.203: U$174.P$1 61.07,47.48 | 61.07,47.48 56.8,47.48 S2.2 56.62,47.3 v55.2,47.3 | 61.07,47.48 U$175.P$1 | v49.51,47.3 52.53,47.3 S2.1 | v42.93,56.37 42.93,58.15 U2.29
  Bottom 0.203: v49.51,47.3 40.8,38.59 40.8,38.06 U$5.P$7 | v42.93,56.37 42.93,53.88 v49.51,47.3 | v49.51,47.3 v55.2,47.3
SCK
  Top 0.203: U2.17 47.56,51.03 40.44,51.03 39.73,50.32 39.73,36.99 40.62,36.1 U$5.P$6
SS  (via drill 0.35)
  Top 0.203: v44.36,41.08 44.36,49.61 U2.14
  Bottom 0.203: v44.36,41.08 41.69,38.41 41.69,30.94 40.8,30.05 U$5.P$3

## Text on the board
tPlace: 5V_IN | toMAIN